# EAGLE design dual.seq.v1.0.0.pnl (EAGLE 7.2.0)
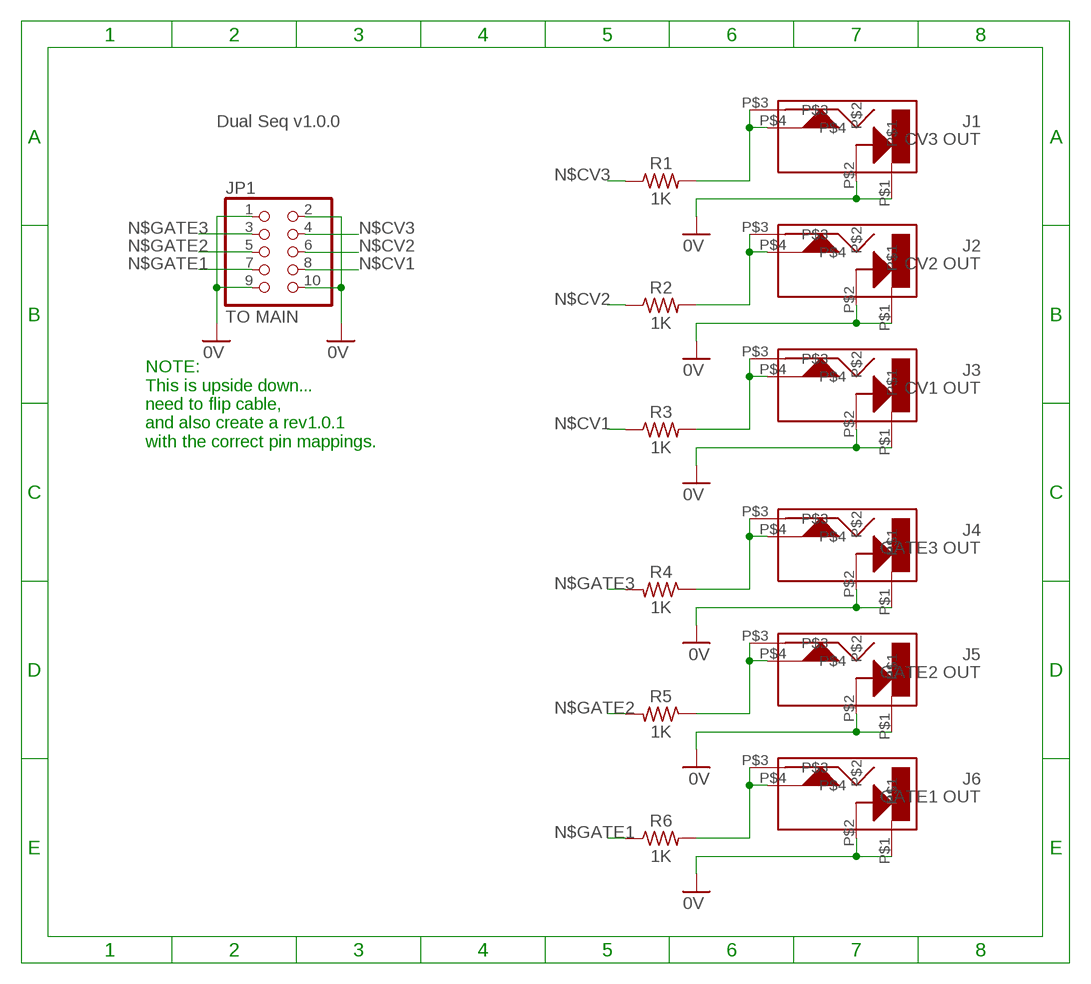
[diagram p0: schematic, sheet 1]

## Parts
J1  CV3 OUT  CL1384  [CL1384]
J2  CV2 OUT  CL1384  [CL1384]
J3  CV1 OUT  CL1384  [CL1384]
J4  GATE3 OUT  CL1384  [CL1384]
J5  GATE2 OUT  CL1384  [CL1384]
J6  GATE1 OUT  CL1384  [CL1384]
JP1  TO MAIN  PINHD-2X5  [2X05]
R1  1K  R  [0207/7]
R2  1K  R  [0207/7]
R3  1K  R  [0207/7]
R4  1K  R  [0207/7]
R5  1K  R  [0207/7]
R6  1K  R  [0207/7]

## Nets
0V [PWR]: J1.P$1 J1.P$2 J2.P$1 J2.P$2 J3.P$1 J3.P$2 J4.P$1 J4.P$2 J5.P$1 J5.P$2 J6.P$1 J6.P$2 JP1.1 JP1.2 JP1.9 JP1.10
N$1: J6.P$3 J6.P$4 R6.2
N$2: J5.P$3 J5.P$4 R5.1
N$3: J4.P$3 J4.P$4 R4.1
N$4: J3.P$3 J3.P$4 R3.2
N$5: J2.P$3 J2.P$4 R2.2
N$6: J1.P$3 J1.P$4 R1.2
N$CV1: JP1.8 R3.1
N$CV2: JP1.6 R2.1
N$CV3: JP1.4 R1.1
N$GATE1: JP1.7 R6.1
N$GATE2: JP1.5 R5.2
N$GATE3: JP1.3 R4.2

## Notes on the sheet
- Dual Seq v1.0.0
- NOTE:
  This is upside down...
  need to flip cable, 
  and also create a rev1.0.1 
  with the correct pin mappings.

## Library data of the parts
J1-J6 = jacks:CL1384
JP1 = pinhead:PINHD-2X5: PIN HEADER
R1-R6 = _common:R: RESISTOR, US symbol

## Net classes
1 PWR: width 0.508 mm

## Board
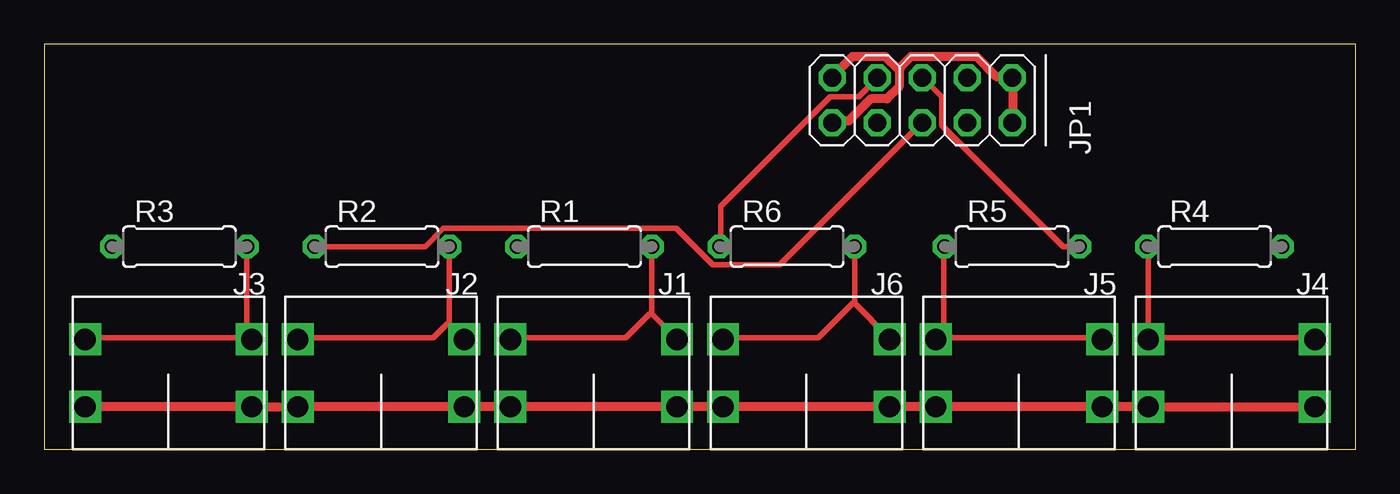
[diagram p1: board, top side]
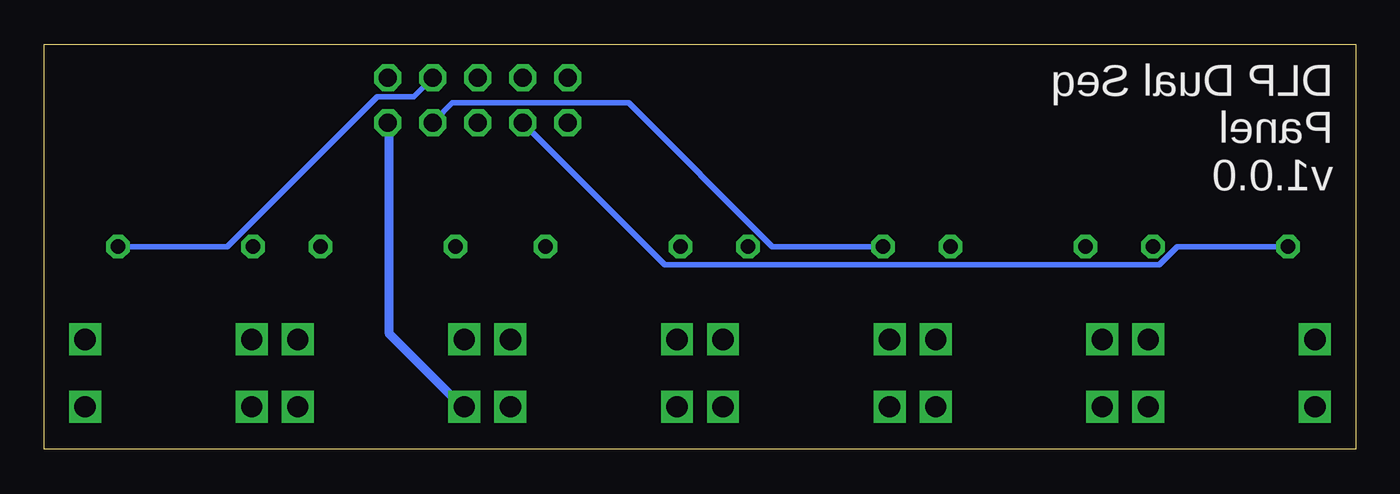
[diagram p2: board, bottom side, seen from below]

Size 74 x 22.85 mm. Coordinates in mm from the lower left corner, seen from the top.
Outline: 0,0 74,0 74,22.85 0,22.85 0,0
Copper layers (1*16): Top 0.035mm / dielectric 1.5mm / Bottom 0.035mm
Design rules "SeeedStudio_2layer_DRU_no_angle_20140221 *": minimum track width 12mil, minimum drill 12mil, track to track 6mil, track to pad 6mil, pad to pad 6mil, via to via 6mil, smd to smd 0mil, copper to edge 10mil, drill to drill 10mil, minimum pad ring 10mil, minimum via ring 6mil, stop-mask expansion 2mil, vias tented up to drill 100mil, thermal gap 10mil

### Footprints (pad centres in the part's own frame; a part is rotated, then mirrored left to right if it is on the bottom)
CL1384 = drill 1.2 square: P$1 0,0; P$2 9.4,0; P$3 0,-3.8; P$4 9.4,-3.8
2X05 = drill 1.016 octagon: 1 -5.08,-1.27; 2 -5.08,1.27; 3 -2.54,-1.27; 4 -2.54,1.27; 5 0,-1.27; 6 0,1.27; 7 2.54,-1.27; 8 2.54,1.27; 9 5.08,-1.27; 10 5.08,1.27
0207/7 = drill 0.813 octagon: 1 -3.81,0; 2 3.81,0

### Placement (x,y rotation side)
J1  35.7,2.4 180 top
J2  23.7,2.4 180 top
J3  11.7,2.4 180 top
J4  71.7,2.4 180 top
J5  59.7,2.4 180 top
J6  47.7,2.4 180 top
JP1  49.53,19.68 180 top
R1  30.48,11.43 0 top
R2  19.05,11.43 0 top
R3  7.62,11.43 0 top
R4  66.04,11.43 0 top
R5  54.61,11.43 0 top
R6  41.91,11.43 0 top

### Tracks (layer width: path | path; a pad name or v marks a point on that pad's centre or on a via)
0V
  Top 0.508: J3.P$2 2.4,2.4 11.66,2.4 J3.P$1 11.89,2.4 14.29,2.4 J2.P$2 14.52,2.4 23.55,2.4 J2.P$1 23.77,2.4 J1.P$2 26.52,2.4 35.55,2.4 J1.P$1 35.78,2.4 J6.P$2 38.52,2.4 47.55,2.4 J6.P$1 47.78,2.4 J5.P$2 50.52,2.4 59.55,2.4 J5.P$1 59.78,2.4 J4.P$2 62.52,2.4 71.67,2.4 J4.P$1 | JP1.2 54.63,18.52 54.63,20.92 JP1.1 54.41,21.03 53.72,21.03 52.58,22.17 48.92,22.17 48.35,21.6 48.23,21.37 | 48.23,21.37 48.23,20.46 47.55,19.77 46.63,19.77 45.38,18.52 44.46,18.52 JP1.10 | 48.23,21.37 47.43,22.17 45.61,22.17 44.46,21.03 JP1.9
  Bottom 0.508: JP1.2 54.52,18.4 54.52,6.51 50.41,2.4 J5.P$2
N$1
  Top 0.305: 45.72,8.23 R6.2 | 45.72,8.23 47.66,6.29 J6.P$3 | J6.P$4 38.41,6.29 43.66,6.29 45.61,8.23 45.72,8.23
N$2
  Top 0.305: R5.1 50.75,11.43 50.75,6.63 50.41,6.29 J5.P$4 50.86,6.63 51.21,6.29 59.66,6.29 J5.P$3
N$3
  Top 0.305: R4.1 62.29,11.43 62.29,6.29 J4.P$4 62.41,6.29 71.67,6.29 J4.P$3
N$4
  Top 0.305: R3.2 11.43,6.51 11.66,6.29 J3.P$3 11.32,6.51 11.09,6.29 2.4,6.29 J3.P$4
N$5
  Top 0.305: 22.86,7.09 R2.2 | 22.86,7.09 23.66,6.29 J2.P$3 | J2.P$4 14.4,6.29 21.95,6.29 22.75,7.09 22.86,7.09
N$6
  Top 0.305: 34.29,7.66 R1.2 | 34.29,7.66 35.66,6.29 J1.P$3 | J1.P$4 26.4,6.29 32.8,6.29 34.18,7.66 34.29,7.66
N$CV1
  Bottom 0.305: R3.1 10.06,11.43 11.09,10.4 38.98,10.4 JP1.8
N$CV2
  Top 0.305: R2.1 21.49,11.43 22.52,12.46 35.66,12.46 37.72,10.4 41.49,10.4 49.49,18.4 JP1.6
N$CV3
  Bottom 0.305: R1.1 32.92,11.43 41.03,19.55 50.98,19.55 52.01,18.52 JP1.4
N$GATE1
  Top 0.305: R6.1 38.18,11.43 38.18,13.72 44.35,19.89 45.95,19.89 46.98,20.92 JP1.7
N$GATE2
  Top 0.305: R5.2 57.49,11.43 50.63,18.29 50.63,19.89 49.61,20.92 JP1.5
N$GATE3
  Bottom 0.305: R4.2 63.66,11.43 55.21,19.89 53.15,19.89 52.12,20.92 JP1.3

### Text on the board
bNames: DLP Dual Seq / Panel / v1.0.0